# Altium project bldc_board.PrjPcb
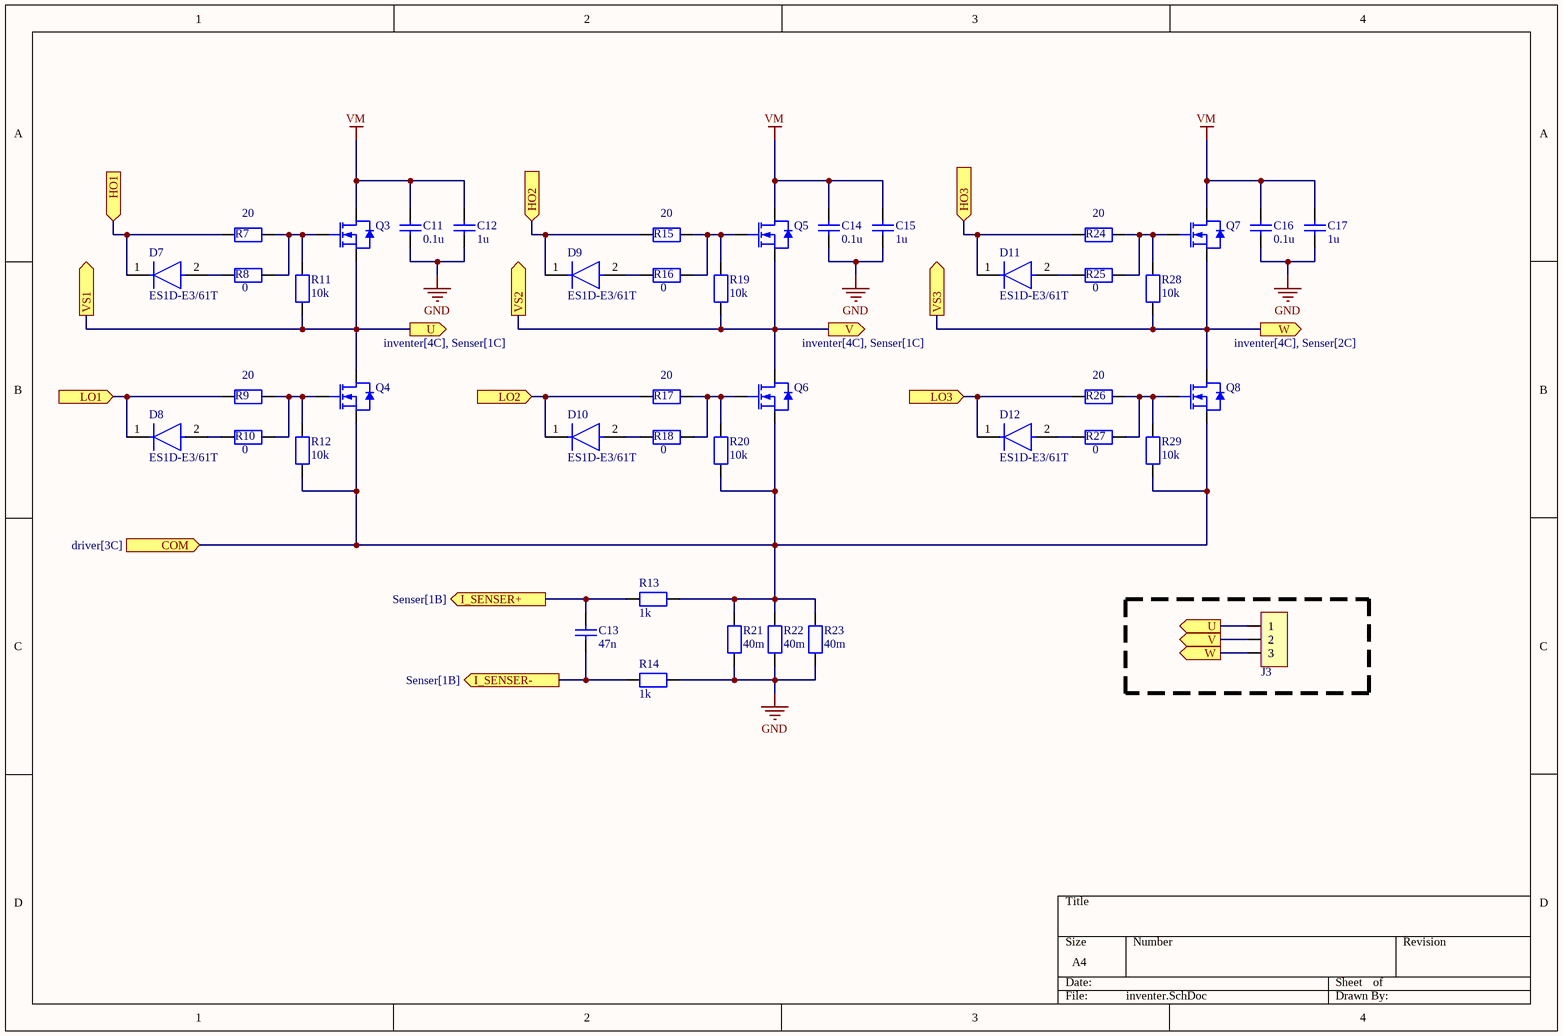
[diagram p0: inventer.SchDoc]
5 sheets, 190 parts. Net scope: flat (ports and power ports of the same name join across sheets).
Board file: My_PCB.PcbDoc
Sheets:
  inventer.SchDoc
  power.SchDoc
  driver.SchDoc
  Senser.SchDoc
  mcu.SchDoc

## Sheet inventer.SchDoc
size A4; SheetNumber: 1; SheetTotal: 5

### Parts
C11  value 0.1u  [CAP_1206]  (hidden comment: CAP)
C12  value 1u  [CAP_1206]  (hidden comment: CAP)
C13  value 47n  [CAPC2012X06N]  (hidden comment: CAP)
C14  value 0.1u  [CAP_1206]  (hidden comment: CAP)
C15  value 1u  [CAP_1206]  (hidden comment: CAP)
C16  value 0.1u  [CAP_1206]  (hidden comment: CAP)
C17  value 1u  [CAP_1206]  (hidden comment: CAP)
D7  ES1D-E3/61T  [FP-95400-MFG]
D8  ES1D-E3/61T  [FP-95400-MFG]
D9  ES1D-E3/61T  [FP-95400-MFG]
D10  ES1D-E3/61T  [FP-95400-MFG]
D11  ES1D-E3/61T  [FP-95400-MFG]
D12  ES1D-E3/61T  [FP-95400-MFG]
J3  Power 3  [Power 3]  (value not drawn)
Q3  IRF1010ZSTRLPBF  [FP-PG-TO263-3-MFG]  (value not drawn)
Q4  IRF1010ZSTRLPBF  [FP-PG-TO263-3-MFG]  (value not drawn)
Q5  IRF1010ZSTRLPBF  [FP-PG-TO263-3-MFG]  (value not drawn)
Q6  IRF1010ZSTRLPBF  [FP-PG-TO263-3-MFG]  (value not drawn)
Q7  IRF1010ZSTRLPBF  [FP-PG-TO263-3-MFG]  (value not drawn)
Q8  IRF1010ZSTRLPBF  [FP-PG-TO263-3-MFG]  (value not drawn)
R7  value 20  [RESC3016X06N]  (hidden comment: 1k)
R8  value 0  [RESC3016X06N]  (hidden comment: 1k)
R9  value 20  [RESC3016X06N]  (hidden comment: 1k)
R10  value 0  [RESC3016X06N]  (hidden comment: 1k)
R11  10k  [RESC2012X06N]
R12  10k  [RESC2012X06N]
R13  value 1k  [RESC2012X06N]  (hidden comment: Resistor)
R14  value 1k  [RESC2012X06N]  (hidden comment: Resistor)
R15  value 20  [RESC3016X06N]  (hidden comment: 1k)
R16  value 0  [RESC3016X06N]  (hidden comment: 1k)
R17  value 20  [RESC3016X06N]  (hidden comment: 1k)
R18  value 0  [RESC3016X06N]  (hidden comment: 1k)
R19  10k  [RESC2012X06N]
R20  10k  [RESC2012X06N]
R21  value 40m  [RESC2512]  (hidden comment: Resistor)
R22  value 40m  [RESC2512]  (hidden comment: Resistor)
R23  value 40m  [RESC2512]  (hidden comment: Resistor)
R24  value 20  [RESC3016X06N]  (hidden comment: 1k)
R25  value 0  [RESC3016X06N]  (hidden comment: 1k)
R26  value 20  [RESC3016X06N]  (hidden comment: 1k)
R27  value 0  [RESC3016X06N]  (hidden comment: 1k)
R28  10k  [RESC2012X06N]
R29  10k  [RESC2012X06N]

### Ports
COM (in, see driver[3C]), HO1 (in, see driver[2A]), HO2 (in, see driver[4A]), HO3 (in, see driver[2C]), I_SENSER+ (out, see Senser[1B]), I_SENSER- (out, see Senser[1B]), LO1 (in, see driver[2B]), LO2 (in, see driver[4B]), LO3 (in, see driver[2C]), U (out, see inventer[2B], Senser[1C]), U (out, see inventer[4C], Senser[1C]), V (out, see inventer[3B], Senser[1C]), V (out, see inventer[4C], Senser[1C]), VS1 (out, see driver[2A]), VS2 (out, see driver[4A]), VS3 (out, see driver[2C]), W (out, see inventer[4B], Senser[2C]), W (out, see inventer[4C], Senser[2C])

### Nets
GND: C11.2 C12.2 C14.2 C15.2 C16.2 C17.2 R14.1 R21.1 R22.1 R23.1
VM: C11.1 C12.1 C14.1 C15.1 C16.1 C17.1 Q3.D Q5.D Q7.D
com: Q4.S Q6.S Q8.S R12.1 R13.1 R20.1 R21.2 R22.2 R23.2 R29.1 ; port COM
U: J3.1 Q3.S Q4.D R11.1 ; port VS1, port U
V: J3.2 Q5.S Q6.D R19.1 ; port VS2, port V
NetC13_1: C13.1 R13.2 ; port I_SENSER+
NetC13_2: C13.2 R14.2 ; port I_SENSER-
NetC20_2: J3.3 Q7.S Q8.D R28.1 ; port VS3, port W
NetD7_1: D7.1(C) R7.1 ; port HO1
NetD7_2: D7.2(A) R8.1
NetD8_1: D8.1(C) R9.1 ; port LO1
NetD8_2: D8.2(A) R10.1
NetD9_1: D9.1(C) R15.1 ; port HO2
NetD9_2: D9.2(A) R16.1
NetD10_1: D10.1(C) R17.1 ; port LO2
NetD10_2: D10.2(A) R18.1
NetD11_1: D11.1(C) R24.1 ; port HO3
NetD11_2: D11.2(A) R25.1
NetD12_1: D12.1(C) R26.1 ; port LO3
NetD12_2: D12.2(A) R27.1
NetQ3_G: Q3.G R7.2 R8.2 R11.2
NetQ4_G: Q4.G R9.2 R10.2 R12.2
NetQ5_G: Q5.G R15.2 R16.2 R19.2
NetQ6_G: Q6.G R17.2 R18.2 R20.2
NetQ7_G: Q7.G R24.2 R25.2 R28.2
NetQ8_G: Q8.G R26.2 R27.2 R29.2

### Library data of the parts
C11 C14 C16 = CAP: Конденсатор керамический smd 0.1 мкФ X7R 50В 10% 1206,; Source: *
C12 C15 C17 = CAP: Конденсатор керамический smd 1 мкФ X7R 50В,10%, 1206; Source: *
C13 = CAP: Конденсатор керамический smd 0.047мкФ X7R 50В 10% 0805; Source: *
D7-D12 = CMP-02540-000037-1: DIODE GEN PURP 200V 1A DO214AC; Manufacturer: Vishay; Standoff Height: 0mm; Peak Reverse Current: 5uA; Value: 10 pF; Max Surge Forward Current: 30A; Max Junction Temp: +150°C; Device Class L3: Rectifier Diodes; RoHS: TRUE; Device Class L1: Discrete Semiconductors; Lead Free: Yes; ComponentLink2Description: Datasheet; Digikey Description: DIODE GEN PURP 200V 1A DO214AC; Device Class L2: Diodes; Package: 95400; Max Repetitive Reverse Voltage: 200V; Footprint Url: http://www.vishay.com/docs/95400/sma.pdf; Temperature Range High: +150°C; ComponentLink2URL: http://www.vishay.com/docs/88586/es1.pdf; Automotive: No; Octopart: https://octopart.com/es1d-e3%2F61t-vishay-39550266; Manufacturer Part Number: ES1D-E3/61T; Temperature: -55°C to +150°C; Category: Diode; Temperature Range Low: -55°C; Height: 2.29mm; Capacitance: 10 pF; Mouser Description: Ultrafast Rectifier, Plastic Surface Mount, 1 A, 200 VDC, DO0214AC (SMA), RoHS; Forward Current: 1A
Q3-Q8 = NMOS: IRF1010ZSTRLPBF, Транзистор HEXFET N-канал 55В 75А; Source: https://www.chipdip.ru/product/irf1010zstrlpbf-infineon
R7 R9 R15 R17 R24 R26 = Resistor: 0.25Вт 1206 20 Ом, 1%; Source: *
R8 R10 R16 R18 R25 R27 = Resistor: 0.25Вт 1206 (перемычка) 0 Ом; Source: *
R11 R12 R19 R20 R28 R29 = Resistor: 0.125Вт 0805 10 кОм, 1%; Value: 10k; Source: *
R13 R14 = Resistor: 0.125Вт 0805 1 кОм, 1%; Source: *
R21-R23 = Resistor: Source: *

## Sheet power.SchDoc
size A4; SheetNumber: 2; SheetTotal: 5
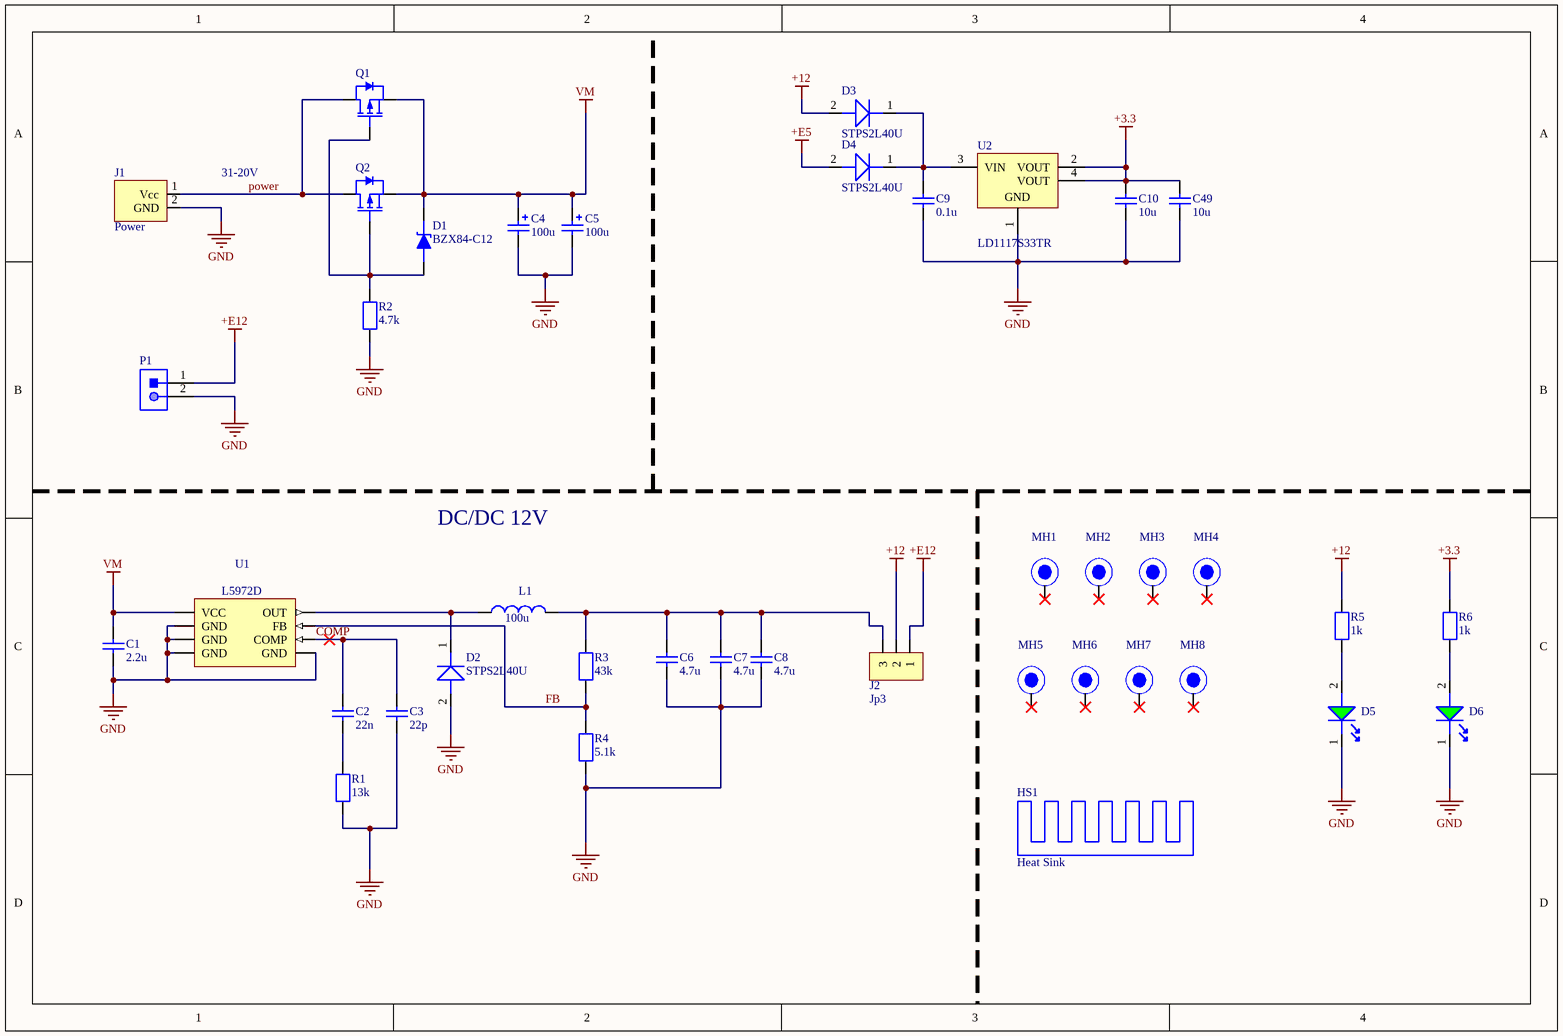
[diagram p1: power.SchDoc]

### Parts
C1  value 2.2u  [CAP_1206]  (hidden comment: CAP)
C2  value 22n  [CAPC2012X06N]  (hidden comment: CAP)
C3  value 22p  [CAPC2012X06N]  (hidden comment: CAP)
C4  value 100u  [B40940]  (hidden comment: Cap_Pos)
C5  value 100u  [B40940]  (hidden comment: Cap_Pos)
C6  value 4.7u  [CAP_1206]  (hidden comment: CAP)
C7  value 4.7u  [CAP_1206]  (hidden comment: CAP)
C8  value 4.7u  [CAP_1206]  (hidden comment: CAP)
C9  value 0.1u  [CAPC2012X06N]  (hidden comment: CAP)
C10  value 10u  [CAPC2012X06N]  (hidden comment: CAP)
C49  value 10u  [CAPC2012X06N]  (hidden comment: CAP)
D1  BZX84-C12  [SOT23]
D2  STPS2L40U  [CAPM3216X18N]
D3  STPS2L40U  [CAPM3216X18N]
D4  STPS2L40U  [CAPM3216X18N]
D5  GREEN  [DIOC3216X06N]  (value not drawn)
D6  GREEN  [DIOC3216X06N]  (value not drawn)
HS1  Heat Sink  [Heat Sink]
J1  Power  [Power Connector]
J2  Jp3  [HEADER 1x3 2.54mm]
L1  value 100u  [HE1040]  (hidden comment: HE1040)
MH1  MH  [MH]  (value not drawn)
MH2  MH  [MH]  (value not drawn)
MH3  MH  [MH]  (value not drawn)
MH4  MH  [MH]  (value not drawn)
MH5  MH  [MH]  (value not drawn)
MH6  MH  [MH]  (value not drawn)
MH7  MH  [MH]  (value not drawn)
MH8  MH  [MH]  (value not drawn)
P1  B2P-VH(LF)(SN)  [JST-B2P-VH(LF)(SN)_V]  (value not drawn)
Q1  IRF4905STRLPBF  [FP-PG-TO263-3-MFG]  (value not drawn)
Q2  IRF4905STRLPBF  [FP-PG-TO263-3-MFG]  (value not drawn)
R1  value 13k  [RESC2012X06N]  (hidden comment: Resistor)
R2  value 4.7k  [RESC2012X06N]  (hidden comment: Resistor)
R3  value 43k  [RESC2012X06N]  (hidden comment: Resistor)
R4  value 5.1k  [RESC2012X06N]  (hidden comment: Resistor)
R5  value 1k  [RESC2012X06N]  (hidden comment: Resistor)
R6  value 1k  [RESC2012X06N]  (hidden comment: Resistor)
U1  L5972D  [SO-8]
U2  LD1117S33TR  [STM-SOT-223_M]

### Nets
+3.3: C10.1 C49.1 R6.2 U2.2(VOUT) U2.4(VOUT)
+12: D3.2(A) J2.2 R5.2
+E5: D4.2(A)
+E12: J2.1 P1.1
GND: C1.2 C3.2 C4.2 C5.2 C6.2 C7.2 C8.2 C9.2 C10.2 C49.2 D2.2(A) D5.1 D6.1 J1.2(GND) P1.2 R1.1 R2.1 R4.1 U1.2(GND) U1.3(GND) U1.6(GND) U1.7(GND) U2.1(GND)
VM: C1.1 C4.1 C5.1 D1.3 Q1.S Q2.S U1.8(VCC)
COMP: C2.1 C3.1 U1.4(COMP)
FB: R3.1 R4.2 U1.5(FB)
power: J1.1(Vcc) Q1.D Q2.D
NetC2_2: C2.2 R1.2
NetC6_1: C6.1 C7.1 C8.1 J2.3 L1.2 R3.2
NetC9_1: C9.1 D3.1(K) D4.1(K) U2.3(VIN)
NetD1_1: D1.1 Q1.G Q2.G R2.2
NetD2_1: D2.1(K) L1.1 U1.1(OUT)
NetD5_2: D5.2 R5.1
NetD6_2: D6.2 R6.1

Not connected (* = marked no-connect by the designer): MH1 1*; MH2 1*; MH3 1*; MH4 1*; MH5 1*; MH6 1*; MH7 1*; MH8 1*

### Notes on the sheet
- 31-20V
- DC/DC 12V

### Library data of the parts
C1 = CAP: GRM21BR71E225K, Конденсатор керамический smd 2.2мкФ X7R 25В 0805; Source: *
C2 = CAP: GRM31MR72A223K, Конденсатор керамический smd 0.022мкФ 100В X7R, 10%; Source: *
C3 = CAP: GRM21A5C2E220J, Конденсатор керамический smd 22пФ C0G 250B 5% 0805; Source: *
C4 C5 = Cap_Pos: B40940A8107M000, 100 мкФ, 63 В,10х12.5, 20%
C6-C8 = CAP: GRM21BR61E475KA12L, Конденсатор керамический smd 4.7 мкФ X5R 10% 25В 0805; Source: *
C9 = CAP: Конденсатор керамический smd 0.01 мкФ NPO 50В 5%; Source: *
C10 C49 = CAP: Capacitor SMD 0805 X7R 10uФ 25В 10%; Source: *
D1 = BZX84-C12: BZX84-C12,215, Стабилитрон 12В, 5%
D2-D4 = DIOD: STPS2L40U, Диод Шоттки 40В 2А; Name: *
D5 D6 = LED_G: TO-3216BC-BF, Светодиод синий SMD 3216
HS1 = Heat Sink: HS 145-100, Радиатор 100х100х26 мм
J2 = Jumper3: PLS-3 (DS1021-1x3), Вилка штыревая 2.54мм 1x3pin
L1 = L: HE1040 101M2B 100мкГн ± 25%
P1 = CMP-002-00025-2: Male Header, Pitch 3.96 mm, 1 x 2 Position, Height 10.9 mm, Tail Length 3.7 mm, -25 to 85 degC, RoHS, Bulk; Manufacturer: JST; Case/Package: B2P-VH(LF)(SN); Connector Type: Header; Mounting Technology: TH; Package Reference: B2P-VH(LF)(SN); Package Description: Male Header, Pitch 3.96 mm, 1 x 2 Position, Height 10.9 mm, Tail Length 3.7 mm; Max Operating Temperature: 85°C; Manufacturer URL: http://www.jst.com/home2.html; RoHS Compliant: Unknown; Datasheet Version: May-16; Gender: Male; Min Operating Temperature: -25°C; Datasheet URL: http://www.jst-mfg.com/product/pdf/eng/eVH.pdf
Q1 Q2 = PMOS: IRF4905STRLPBF, Транзистор HEXFET, P-канал, 55В, 74А
R1 = Resistor: 0.125Вт 0805 13 кОм, 1%; Source: *
R2 = Resistor: 0.125Вт 0805 4.7 кОм, 1%; Source: *
R3 = Resistor: 0.125Вт 0805 43 кОм, 1%; Source: *
R4 = Resistor: 0.125Вт 0805 5.1 кОм, 1%; Source: *
R5 R6 = Resistor: 0.125Вт 0805 1 кОм, 1%; Source: *
U1 = L5972D: Buck Switching Regulator IC Positive Adjustable 1.235V 1 Output 2A 8-SOIC (0.154", 3.90mm Width)
U2 = CMP-019-00019-3: Low Drop Positive Voltage Regulator, 800 mA, Fixed 3.3 V Output, 0 to 125 degC, 3-Pin TO-220, RoHS, Tape and Reel; Manufacturer: STMicroelectronics; Max Supply Voltage: 15V; Dropout Voltage: 1.1V; Power: 12W; Output Current: 950mA; Min Input Voltage: 4.75V; Nominal Output Voltage: 3.3V; Max Ouput Current: 1.3A; Outputs: 1; Packaging: TapeandReel; Datasheet Version: Rev. 33, 11/2013; RoHS Compliant: True; Mounting Technology: SM; Max Input Voltage: 15V; Max Operating Temperature: 125°C; Package Reference: SOT-223; Package Quantity: 2500; Package Description: 4-Pin Small Outline Transistor, Body 6.5 x 3.5 mm, Pitch 2.3 mm; Case/Package: TO-261-4; Min Operating Temperature: 0°C; Datasheet URL: http://www.farnell.com/datasheets/1776449.pdf; Min Supply Voltage: 4.75V; Pins: 3; Output Voltage: 3.3V; Manufacturer URL: http://www.st.com/

## Sheet driver.SchDoc
size A4; SheetNumber: 3; SheetTotal: 5
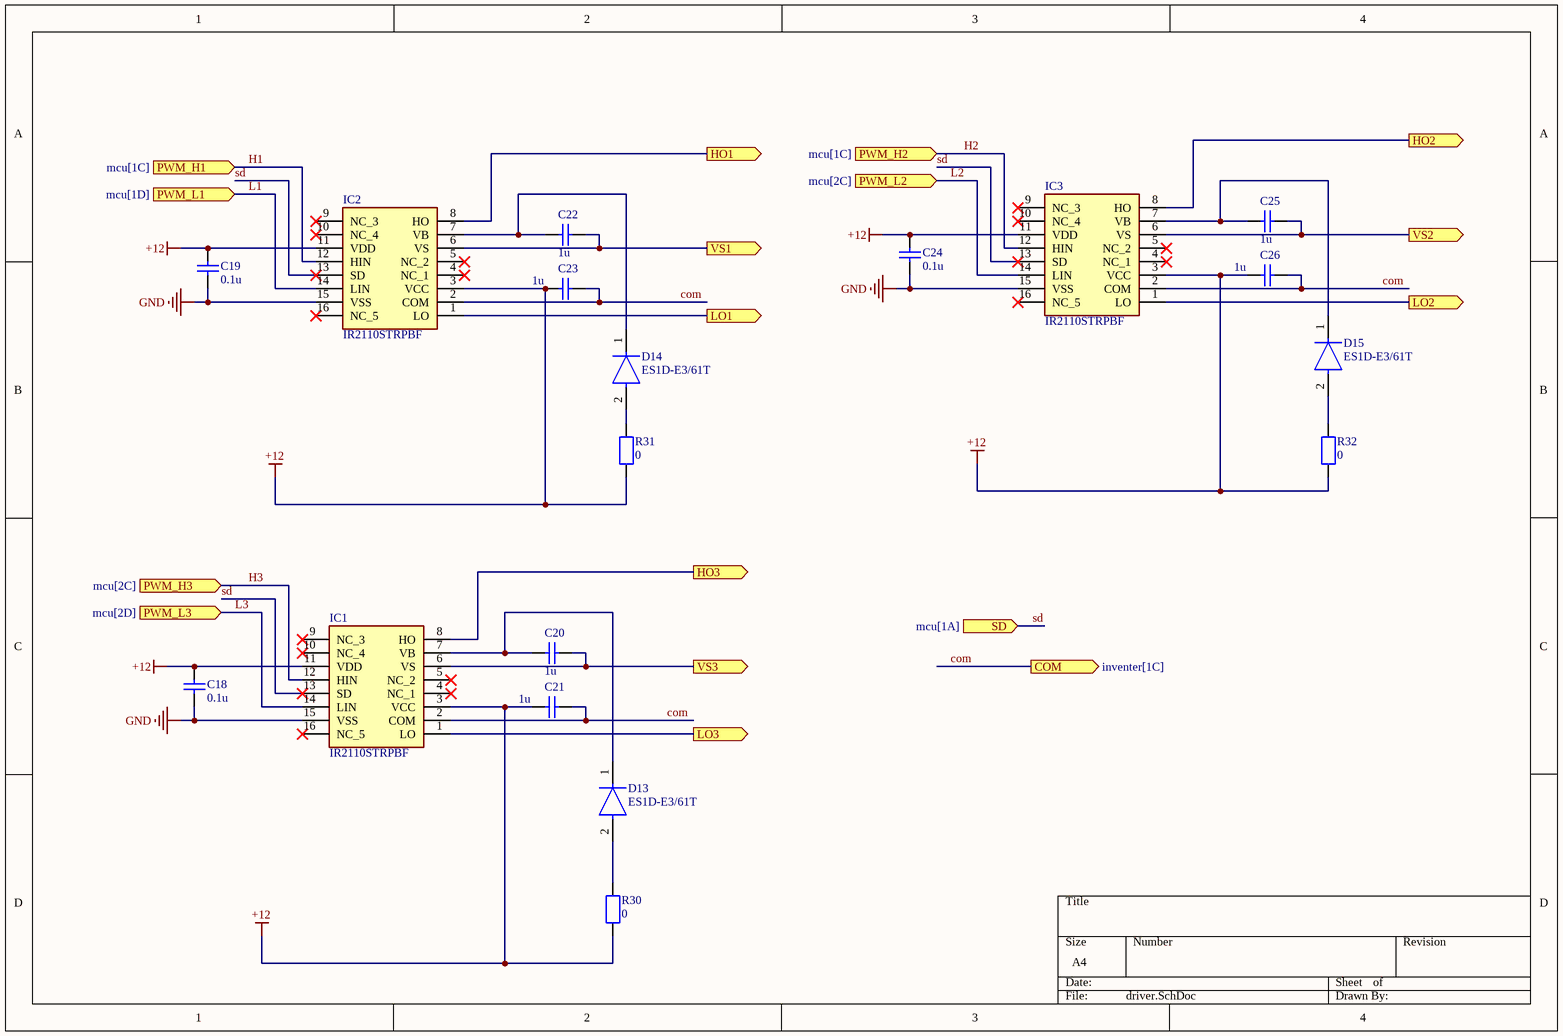
[diagram p2: driver.SchDoc]

### Parts
C18  value 0.1u  [CAPC2012X06N]  (hidden comment: CAP)
C19  value 0.1u  [CAPC2012X06N]  (hidden comment: CAP)
C20  value 1u  [CAPC2012X06N]  (hidden comment: CAP)
C21  value 1u  [CAPC2012X06N]  (hidden comment: CAP)
C22  value 1u  [CAPC2012X06N]  (hidden comment: CAP)
C23  value 1u  [CAPC2012X06N]  (hidden comment: CAP)
C24  value 0.1u  [CAPC2012X06N]  (hidden comment: CAP)
C25  value 1u  [CAPC2012X06N]  (hidden comment: CAP)
C26  value 1u  [CAPC2012X06N]  (hidden comment: CAP)
D13  ES1D-E3/61T  [FP-95400-MFG]
D14  ES1D-E3/61T  [FP-95400-MFG]
D15  ES1D-E3/61T  [FP-95400-MFG]
IC1  IR2110STRPBF  [SOIC127P1032X265-16N]
IC2  IR2110STRPBF  [SOIC127P1032X265-16N]
IC3  IR2110STRPBF  [SOIC127P1032X265-16N]
R30  value 0  [RESC3016X06N]  (hidden comment: Resistor)
R31  value 0  [RESC3016X06N]  (hidden comment: Resistor)
R32  value 0  [RESC3016X06N]  (hidden comment: Resistor)

### Ports
COM (out, see inventer[1C]), HO1 (out, see inventer[1A]), HO2 (out, see inventer[2A]), HO3 (out, see inventer[3A]), LO1 (out, see inventer[1B]), LO2 (out, see inventer[2B]), LO3 (out, see inventer[3B]), PWM_H1 (in, see mcu[1C]), PWM_H2 (in, see mcu[1C]), PWM_H3 (in, see mcu[2C]), PWM_L1 (in, see mcu[1D]), PWM_L2 (in, see mcu[2C]), PWM_L3 (in, see mcu[2D]), SD (in, see mcu[1A]), VS1 (out, see inventer[1B]), VS2 (out, see inventer[2B]), VS3 (out, see inventer[3B])

### Nets
+12: C18.1 C19.1 C21.2 C23.2 C24.1 C26.2 IC1.3(VCC) IC1.11(VDD) IC2.3(VCC) IC2.11(VDD) IC3.3(VCC) IC3.11(VDD) R30.1 R31.1 R32.1
GND: C18.2 C19.2 C24.2 IC1.15(VSS) IC2.15(VSS) IC3.15(VSS)
com: C21.1 C23.1 C26.1 IC1.2(COM) IC2.2(COM) IC3.2(COM) ; port COM
H1: IC2.12(HIN) ; port PWM_H1
H2: IC3.12(HIN) ; port PWM_H2
H3: IC1.12(HIN) ; port PWM_H3
L1: IC2.14(LIN) ; port PWM_L1
L2: IC3.14(LIN) ; port PWM_L2
L3: IC1.14(LIN) ; port PWM_L3
sd: IC1.13(SD) IC2.13(SD) IC3.13(SD) ; port SD
U: C22.2 IC2.6(VS) ; port VS1
V: C25.2 IC3.6(VS) ; port VS2
NetC20_1: C20.1 D13.1(C) IC1.7(VB)
NetC20_2: C20.2 IC1.6(VS) ; port VS3
NetC22_1: C22.1 D14.1(C) IC2.7(VB)
NetC25_1: C25.1 D15.1(C) IC3.7(VB)
NetD7_1: IC2.8(HO) ; port HO1
NetD8_1: IC2.1(LO) ; port LO1
NetD9_1: IC3.8(HO) ; port HO2
NetD10_1: IC3.1(LO) ; port LO2
NetD11_1: IC1.8(HO) ; port HO3
NetD12_1: IC1.1(LO) ; port LO3
NetD13_2: D13.2(A) R30.2
NetD14_2: D14.2(A) R31.2
NetD15_2: D15.2(A) R32.2

Not connected (* = marked no-connect by the designer): IC1 4(NC_1)* 5(NC_2)* 9(NC_3)* 10(NC_4)* 16(NC_5)*; IC2 4(NC_1)* 5(NC_2)* 9(NC_3)* 10(NC_4)* 16(NC_5)*; IC3 4(NC_1)* 5(NC_2)* 9(NC_3)* 10(NC_4)* 16(NC_5)*

### Library data of the parts
C18 C19 C24 = CAP: as C9 on sheet power; Source: *
C20-C23 C25 C26 = CAP: Конденсатор керамический smd 1 мкФ X7R 10% 50В 0805; Source: *
D13-D15 = CMP-02540-000037-1: as D7 on sheet inventer; Device Class L3: Rectifier Diodes; RoHS: TRUE; Device Class L1: Discrete Semiconductors; Lead Free: Yes; ComponentLink2Description: Datasheet; Digikey Description: DIODE GEN PURP 200V 1A DO214AC; Device Class L2: Diodes; Package: 95400; Max Repetitive Reverse Voltage: 200V; Footprint Url: http://www.vishay.com/docs/95400/sma.pdf; Temperature Range High: +150°C; ComponentLink2URL: http://www.vishay.com/docs/88586/es1.pdf; Automotive: No; Octopart: https://octopart.com/es1d-e3%2F61t-vishay-39550266; Manufacturer Part Number: ES1D-E3/61T; Temperature: -55°C to +150°C; Category: Diode; Temperature Range Low: -55°C; Height: 2.29mm; Capacitance: 10 pF; Mouser Description: Ultrafast Rectifier, Plastic Surface Mount, 1 A, 200 VDC, DO0214AC (SMA), RoHS; Forward Current: 1A
IC1-IC3 = IR2110STRPBF: IR2110STRPBF, Полумостовой драйвер HIGH/LOW SIDE; Manufacturer_Name: Infineon; Datasheet Link: https://www.infineon.com/cms/en/product/power/gate-driver-ics/?; Height: 2.65mm; Manufacturer_Part_Number: IR2110STRPBF; Mouser Part Number: 942-IR2110STRPBF; Mouser Price/Stock: https://www.mouser.co.uk/ProductDetail/Infineon-Technologies/IR2110STRPBF?qs=2r01AXMCG3P4pNuJUqFzxg%3D%3D; Arrow Part Number: IR2110STRPBF; Arrow Price/Stock: https://www.arrow.com/en/products/ir2110strpbf/infineon-technologies-ag?region=nac
R30-R32 = Resistor: Source: *

## Sheet Senser.SchDoc
size A4; SheetNumber: 4; SheetTotal: 5
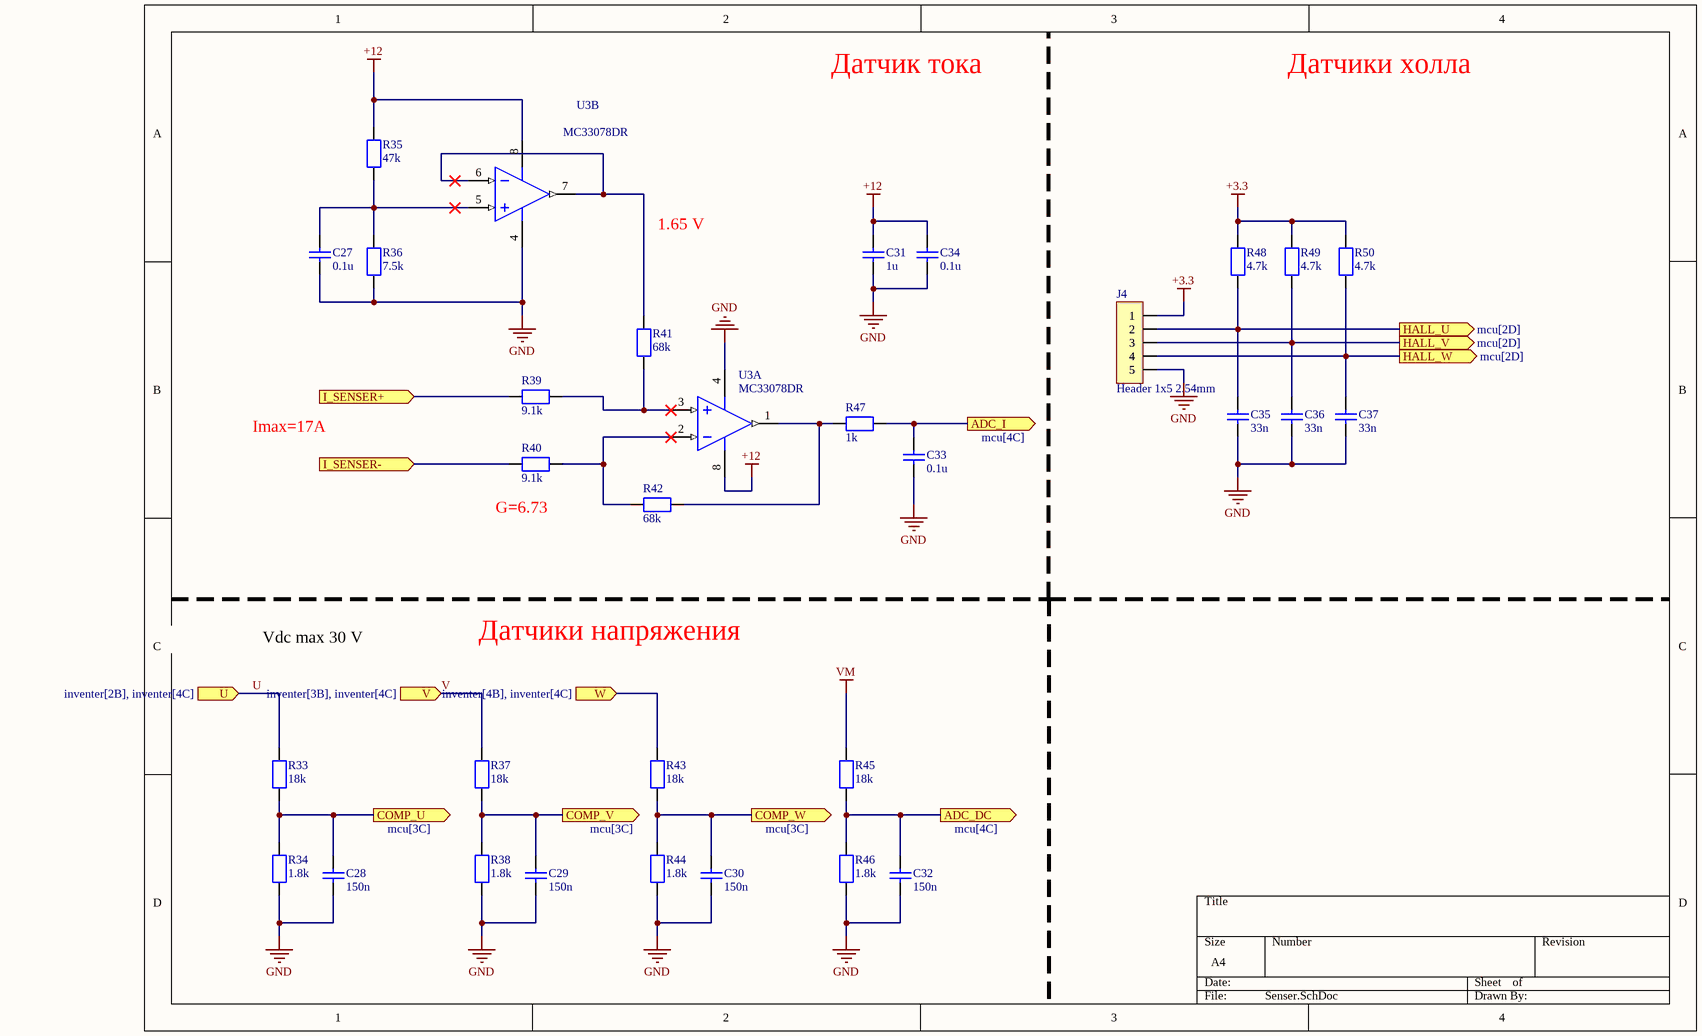
[diagram p3: Senser.SchDoc]

### Parts
C27  value 0.1u  [CAPC2012X06N]  (hidden comment: CAP)
C28  value 150n  [CAPC2012X06N]  (hidden comment: CAP)
C29  value 150n  [CAPC2012X06N]  (hidden comment: CAP)
C30  value 150n  [CAPC2012X06N]  (hidden comment: CAP)
C31  value 1u  [CAPC2012X06N]  (hidden comment: CAP)
C32  value 150n  [CAPC2012X06N]  (hidden comment: CAP)
C33  value 0.1u  [CAPC2012X06N]  (hidden comment: CAP)
C34  value 0.1u  [CAPC2012X06N]  (hidden comment: CAP)
C35  value 33n  [CAPC2012X06N]  (hidden comment: CAP)
C36  value 33n  [CAPC2012X06N]  (hidden comment: CAP)
C37  value 33n  [CAPC2012X06N]  (hidden comment: CAP)
J4  Header 1x5 2.54mm  [Header 1x5 2.54mm]
R33  value 18k  [RESC2012X06N]  (hidden comment: Resistor)
R34  value 1.8k  [RESC2012X06N]  (hidden comment: Resistor)
R35  value 47k  [RESC2012X06N]  (hidden comment: Resistor)
R36  value 7.5k  [RESC2012X06N]  (hidden comment: Resistor)
R37  value 18k  [RESC2012X06N]  (hidden comment: Resistor)
R38  value 1.8k  [RESC2012X06N]  (hidden comment: Resistor)
R39  value 9.1k  [RESC2012X06N]  (hidden comment: Resistor)
R40  value 9.1k  [RESC2012X06N]  (hidden comment: Resistor)
R41  value 68k  [RESC2012X06N]  (hidden comment: Resistor)
R42  value 68k  [RESC2012X06N]  (hidden comment: Resistor)
R43  value 18k  [RESC2012X06N]  (hidden comment: Resistor)
R44  value 1.8k  [RESC2012X06N]  (hidden comment: Resistor)
R45  value 18k  [RESC2012X06N]  (hidden comment: Resistor)
R46  value 1.8k  [RESC2012X06N]  (hidden comment: Resistor)
R47  value 1k  [RESC2012X06N]  (hidden comment: Resistor)
R48  value 4.7k  [RESC2012X06N]  (hidden comment: Resistor)
R49  value 4.7k  [RESC2012X06N]  (hidden comment: Resistor)
R50  value 4.7k  [RESC2012X06N]  (hidden comment: Resistor)
U3  MC33078DR  [D0008A_L]  (parts A,B of 2)

### Ports
ADC_DC (out, see mcu[4C]), ADC_I (out, see mcu[4C]), COMP_U (out, see mcu[3C]), COMP_V (out, see mcu[3C]), COMP_W (out, see mcu[3C]), HALL_U (out, see mcu[2D]), HALL_V (out, see mcu[2D]), HALL_W (out, see mcu[2D]), I_SENSER+ (in, see inventer[2C]), I_SENSER- (in, see inventer[2C]), U (in, see inventer[2B], inventer[4C]), V (in, see inventer[3B], inventer[4C]), W (in, see inventer[4B], inventer[4C])

### Nets
+3.3: J4.1 R48.2 R49.2 R50.2
+12: C31.1 C34.1 R35.2 U3.8(VCC+)
GND: C27.2 C28.2 C29.2 C30.2 C31.2 C32.2 C33.2 C34.2 C35.2 C36.2 C37.2 J4.5 R34.1 R36.1 R38.1 R44.1 R46.1 U3.4(VCC-)
VM: R45.2
U: R33.2 ; port U
V: R37.2 ; port V
NetC13_1: R39.1 ; port I_SENSER+
NetC13_2: R40.1 ; port I_SENSER-
NetC20_2: R43.2 ; port W
NetC27_1: C27.1 R35.1 R36.2 U3.5(IN2+)
NetC28_1: C28.1 R33.1 R34.2 ; port COMP_U
NetC29_1: C29.1 R37.1 R38.2 ; port COMP_V
NetC30_1: C30.1 R43.1 R44.2 ; port COMP_W
NetC32_1: C32.1 R45.1 R46.2 ; port ADC_DC
NetC33_1: C33.1 R47.2 ; port ADC_I
NetC35_1: C35.1 J4.2 R48.1 ; port HALL_U
NetC36_1: C36.1 J4.3 R49.1 ; port HALL_V
NetC37_1: C37.1 J4.4 R50.1 ; port HALL_W
NetR39_2: R39.2 R41.1 U3.3(IN1+)
NetR40_2: R40.2 R42.2 U3.2(IN1-)
NetR41_2: R41.2 U3.6(IN2-) U3.7(OUT2)
NetR42_1: R42.1 R47.1 U3.1(OUT1)

### Notes on the sheet
- Датчик тока
- Датчики холла
- 1.65 V
- Imax=17A
- (near R40) G=6.73
- Vdc max 30 V
- Датчики напряжения

### Library data of the parts
C27 C34 = CAP: Конденсатор керамический smd 0.1 мкФ X7R 50В 10% 0805; Source: *
C28-C30 C32 = CAP: Конденсатор керамический smd 0.15мкФ X7R 50В 10% 0805; Source: *
C31 = CAP: as C20 on sheet driver; Source: *
C33 = CAP: as C9 on sheet power; Source: *
C35-C37 = CAP: Конденсатор керамический smd 0.033мкФ X7R 50В 10% 0805; Source: *
J4 = Header 1x5: PLS-5 (DS1021-1x5), Вилка штыревая 2.54мм 1x5pin
R33 R37 R43 R45 = Resistor: 0.125Вт 0805 12 кОм, 1%; Source: *
R34 R38 R44 R46 = Resistor: 0.125Вт 0805 1.5 кОм, 1%; Source: *
R35 = Resistor: 0.125Вт 0805 47 кОм, 1%; Source: *
R36 = Resistor: 0.125Вт 0805 7.5 кОм, 1%; Source: *
R39 R40 = Resistor: 0.125Вт 0805 9.1 кОм, 1%; Source: *
R41 R42 = Resistor: 0.125Вт 0805 68 кОм, 1%; Source: *
R47 = Resistor: 0.125Вт 0805 1 кОм, 1%; Source: *
R48-R50 = Resistor: 0.125Вт 0805 4.7 кОм, 1%; Source: *
U3 = CMP-0017-00420-2: Dual High-Speed Low-Noise Operational Amplifier, 10 to 36 V, -40 to 85 degC, 8-pin SOIC (D8), Green (RoHS & no Sb/Br); Manufacturer: Texas Instruments; Total Supply Voltage(Min)(+5V is 5, +/-5V is 10): 10; Slew Rate(Typ)(V/us): 7; Offset Drift(Typ)(uV/C): 2; CMRR(Min)(dB): 80; Sub Family: General Purpose Amplifier, High Supply Voltage Amplifier (>=30V), Low Noise Amp (<=10nV/rtHz); GBW(Typ)(MHz): 16; Iq per channel(Max)(mA): 2.5; Vn at 1kHz(Typ)(nV/rtHz): 4.5; Total Supply Voltage(Max)(+5V is 5, +/-5V is 10): 36; Rating: Catalog; IIB(Max)(pA): 750000; ComponentLink1URL: http://www.ti.com/; ComponentLink2Description: Datasheet; ComponentLink3URL: http://www.ti.com/litv/pdf/msoi002j; Number of Channels: 2; Mounting Technology: Surface Mount; Vio (25C)(Max)(mV): 2; DatasheetVersion: SLLS633C; PackageDescription: 8-Pin Plastic Small Outline, Body 4.9 x 3.9 mm, Pitch 1.27 mm; Eco-Plan: Green (RoHS & no Sb/Br); ComponentLink1Description: Manufacturer URL; PackageVersion: 4040047-3/M, 06/2011; ComponentLink3Description: Package Specification; PackageReference: D0008A; PartNumber: MC33078DR; Code_JEDEC: MS-012; ComponentLink2URL: http://www.ti.com/lit/ds/symlink/mc33078.pdf

## Sheet mcu.SchDoc
size A3; SheetNumber: 5; SheetTotal: 5
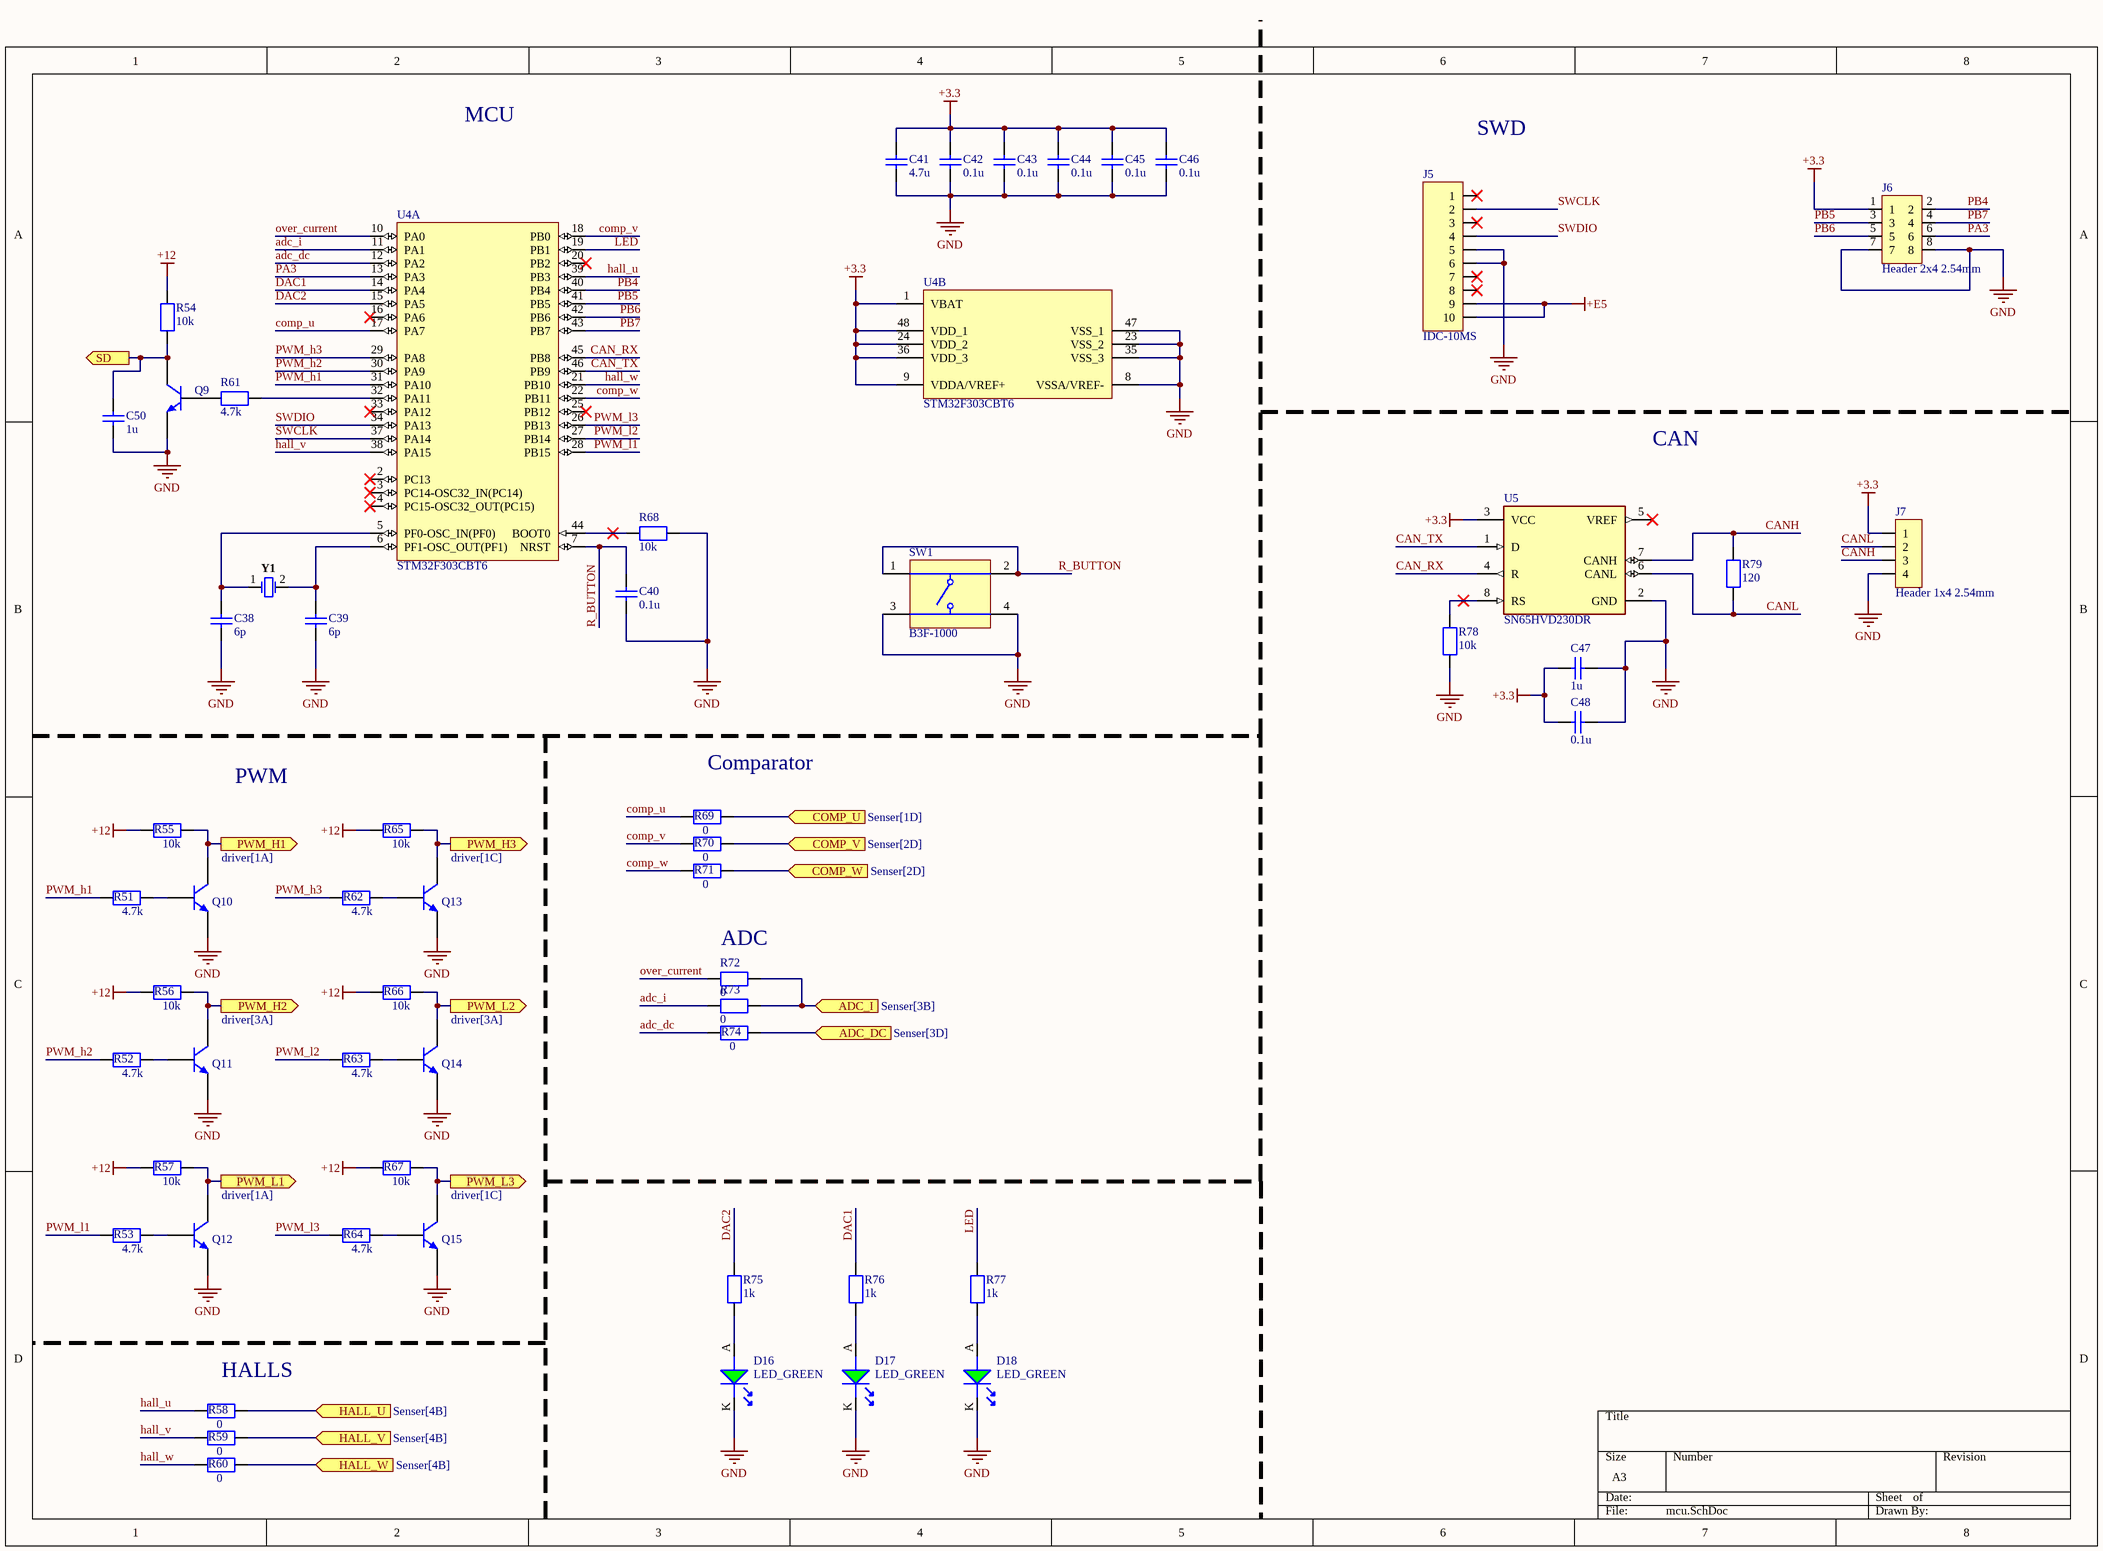
[diagram p4: mcu.SchDoc]

### Parts
C38  value 6p  [CAPC2012X06N]  (hidden comment: CAP)
C39  value 6p  [CAPC2012X06N]  (hidden comment: CAP)
C40  value 0.1u  [CAPC2012X06N]  (hidden comment: CAP)
C41  value 4.7u  [CAPC2012X06N]  (hidden comment: CAP)
C42  value 0.1u  [CAPC2012X06N]  (hidden comment: CAP)
C43  value 0.1u  [CAPC2012X06N]  (hidden comment: CAP)
C44  value 0.1u  [CAPC2012X06N]  (hidden comment: CAP)
C45  value 0.1u  [CAPC2012X06N]  (hidden comment: CAP)
C46  value 0.1u  [CAPC2012X06N]  (hidden comment: CAP)
C47  value 1u  [CAPC2012X06N]  (hidden comment: CAP)
C48  value 0.1u  [CAPC2012X06N]  (hidden comment: CAP)
C50  value 1u  [CAPC2012X06N]  (hidden comment: CAP)
D16  LED_GREEN  [LED_3216]
D17  LED_GREEN  [LED_3216]
D18  LED_GREEN  [LED_3216]
J5  IDC-10MS  [IDC-10MS]
J6  Header 2x4 2.54mm  [Header 2x4 2.54mm]
J7  Header 1x4 2.54mm  [Header 1x4 2.54mm]
Q9  NPN  [SOT23]  (value not drawn)
Q10  NPN  [SOT23]  (value not drawn)
Q11  NPN  [SOT23]  (value not drawn)
Q12  NPN  [SOT23]  (value not drawn)
Q13  NPN  [SOT23]  (value not drawn)
Q14  NPN  [SOT23]  (value not drawn)
Q15  NPN  [SOT23]  (value not drawn)
R51  value 4.7k  [RESC2012X06N]  (hidden comment: Resistor)
R52  value 4.7k  [RESC2012X06N]  (hidden comment: Resistor)
R53  value 4.7k  [RESC2012X06N]  (hidden comment: Resistor)
R54  value 10k  [RESC2012X06N]  (hidden comment: Resistor)
R55  value 10k  [RESC2012X06N]  (hidden comment: Resistor)
R56  value 10k  [RESC2012X06N]  (hidden comment: Resistor)
R57  value 10k  [RESC2012X06N]  (hidden comment: Resistor)
R58  value 0  [RESC2012X06N]  (hidden comment: Resistor)
R59  value 0  [RESC2012X06N]  (hidden comment: Resistor)
R60  value 0  [RESC2012X06N]  (hidden comment: Resistor)
R61  value 4.7k  [RESC2012X06N]  (hidden comment: Resistor)
R62  value 4.7k  [RESC2012X06N]  (hidden comment: Resistor)
R63  value 4.7k  [RESC2012X06N]  (hidden comment: Resistor)
R64  value 4.7k  [RESC2012X06N]  (hidden comment: Resistor)
R65  value 10k  [RESC2012X06N]  (hidden comment: Resistor)
R66  value 10k  [RESC2012X06N]  (hidden comment: Resistor)
R67  value 10k  [RESC2012X06N]  (hidden comment: Resistor)
R68  value 10k  [RESC2012X06N]  (hidden comment: Resistor)
R69  value 0  [RESC2012X06N]  (hidden comment: Resistor)
R70  value 0  [RESC2012X06N]  (hidden comment: Resistor)
R71  value 0  [RESC2012X06N]  (hidden comment: Resistor)
R72  value 0  [RESC2012X06N]  (hidden comment: Resistor)
R73  value 0  [RESC2012X06N]  (hidden comment: Resistor)
R74  value 0  [RESC2012X06N]  (hidden comment: Resistor)
R75  value 1k  [RESC2012X06N]  (hidden comment: Resistor)
R76  value 1k  [RESC2012X06N]  (hidden comment: Resistor)
R77  value 1k  [RESC2012X06N]  (hidden comment: Resistor)
R78  value 10k  [RESC2012X06N]  (hidden comment: Resistor)
R79  value 120  [RESC2012X06N]  (hidden comment: Resistor)
SW1  B3F-1000  [OMRON-B3F-1000-4_V]
U4  STM32F303CBT6  [STM-LQFP48_L]  (parts A,B of 2)
U5  SN65HVD230DR  [FP-D0008A-IPC_A]
Y1  NX3225GD-8MHZ-STD-CRA-3  [NDK-NX3225GD-8MHZ-STD-CRA-3_V]  (value not drawn)

### Ports
ADC_DC (in, see Senser[3D]), ADC_I (in, see Senser[3B]), COMP_U (in, see Senser[1D]), COMP_V (in, see Senser[2D]), COMP_W (in, see Senser[2D]), HALL_U (in, see Senser[4B]), HALL_V (in, see Senser[4B]), HALL_W (in, see Senser[4B]), PWM_H1 (out, see driver[1A]), PWM_H2 (out, see driver[3A]), PWM_H3 (out, see driver[1C]), PWM_L1 (out, see driver[1A]), PWM_L2 (out, see driver[3A]), PWM_L3 (out, see driver[1C]), SD (out, see driver[3C])

### Nets
+3.3: C41.1 C42.1 C43.1 C44.1 C45.1 C46.1 C47.2 C48.2 J6.1 J7.1 U4.1(VBAT) U4.9(VDDA/VREF+) U4.24(VDD_2) U4.36(VDD_3) U4.48(VDD_1) U5.3(VCC)
+12: R54.2 R55.1 R56.1 R57.1 R65.1 R66.1 R67.1
+E5: J5.9 J5.10
GND: C38.2 C39.2 C40.2 C41.2 C42.2 C43.2 C44.2 C45.2 C46.2 C47.1 C48.1 C50.2 D16.K D17.K D18.K J5.5 J5.6 J6.7 J6.8 J7.4 Q9.2(E) Q10.2(E) Q11.2(E) Q12.2(E) Q13.2(E) Q14.2(E) Q15.2(E) R68.2 R78.1 SW1.3 SW1.4 U4.8(VSSA/VREF-) U4.23(VSS_2) U4.35(VSS_3) U4.47(VSS_1) U5.2(GND)
adc_dc: R74.1 U4.12(PA2)
adc_i: R73.1 U4.11(PA1)
CAN_RX: U4.45(PB8) U5.4(R)
CAN_TX: U4.46(PB9) U5.1(D)
CANH: J7.3 R79.2 U5.7(CANH)
CANL: J7.2 R79.1 U5.6(CANL)
comp_u: R69.1 U4.17(PA7)
comp_v: R70.1 U4.18(PB0)
comp_w: R71.1 U4.22(PB11)
DAC1: R76.2 U4.14(PA4)
DAC2: R75.2 U4.15(PA5)
H1: Q10.3(C) R55.2 ; port PWM_H1
H2: Q11.3(C) R56.2 ; port PWM_H2
H3: Q13.3(C) R65.2 ; port PWM_H3
hall_u: R58.1 U4.39(PB3)
hall_v: R59.1 U4.38(PA15)
hall_w: R60.1 U4.21(PB10)
L1: Q12.3(C) R57.2 ; port PWM_L1
L2: Q14.3(C) R66.2 ; port PWM_L2
L3: Q15.3(C) R67.2 ; port PWM_L3
LED: R77.2 U4.19(PB1)
over_current: R72.1 U4.10(PA0)
PA3: J6.6 U4.13(PA3)
PB4: J6.2 U4.40(PB4)
PB5: J6.3 U4.41(PB5)
PB6: J6.5 U4.42(PB6)
PB7: J6.4 U4.43(PB7)
PWM_h1: R51.1 U4.31(PA10)
PWM_h2: R52.1 U4.30(PA9)
PWM_h3: R62.1 U4.29(PA8)
PWM_l1: R53.1 U4.28(PB15)
PWM_l2: R63.1 U4.27(PB14)
PWM_l3: R64.1 U4.26(PB13)
R_BUTTON: C40.1 SW1.1 SW1.2 U4.7(NRST)
sd: C50.1 Q9.3(C) R54.1 ; port SD
SWCLK: J5.2 U4.37(PA14)
SWDIO: J5.4 U4.34(PA13)
NetC28_1: R69.2 ; port COMP_U
NetC29_1: R70.2 ; port COMP_V
NetC30_1: R71.2 ; port COMP_W
NetC32_1: R74.2 ; port ADC_DC
NetC33_1: R72.2 R73.2 ; port ADC_I
NetC35_1: R58.2 ; port HALL_U
NetC36_1: R59.2 ; port HALL_V
NetC37_1: R60.2 ; port HALL_W
NetC38_1: C38.1 U4.5(PF0-OSC_IN(PF0)) Y1.1
NetC39_1: C39.1 U4.6(PF1-OSC_OUT(PF1)) Y1.2
NetD16_A: D16.A R75.1
NetD17_A: D17.A R76.1
NetD18_A: D18.A R77.1
NetQ9_1: Q9.1(B) R61.1
NetQ10_1: Q10.1(B) R51.2
NetQ11_1: Q11.1(B) R52.2
NetQ12_1: Q12.1(B) R53.2
NetQ13_1: Q13.1(B) R62.2
NetQ14_1: Q14.1(B) R63.2
NetQ15_1: Q15.1(B) R64.2
NetR61_2: R61.2 U4.32(PA11)
NetR68_1: R68.1 U4.44(BOOT0)
NetR78_2: R78.2 U5.8(RS)

Not connected (* = marked no-connect by the designer): J5 1* 3* 7* 8*; U4 2(PC13)* 3(PC14-OSC32_IN(PC14))* 4(PC15-OSC32_OUT(PC15))* 16(PA6)* 20(PB2)* 25(PB12)* 33(PA12)*; U5 5(VREF)*

### Notes on the sheet
- MCU
- SWD
- CAN
- PWM
- (near R69) Comparator
- (near R72) ADC
- (near R58) HALLS

### Library data of the parts
C40 C42-C46 = CAP: as C27 on sheet Senser; Source: *
C41 = CAP: Конденсатор керамический smd 4.7 мкФ X5R 10% 25В 0805; Source: *
C47 C50 = CAP: as C20 on sheet driver; Source: *
D16-D18 = LED_GREEN: TO-3216BC-BF, Светодиод синий SMD 3216
J5 = IDC-10MS: Вилка на плату прямая 2x5 2.54мм
J6 = Header 2x4
J7 = Header 1x4: PLS-4 (DS-1021-1x4), Вилка штыревая 2.54мм 1x4pin
Q9-Q15 = NPN: BC817,215, Транзистор NPN 45В 0.5А
R51-R53 R61-R64 = Resistor: 0.125Вт 0805 4.7 кОм, 1%; Source: *
R54-R57 R65-R68 R78 = Resistor: 0.125Вт 0805 10 кОм, 1%; Source: *
R58-R60 R69-R74 = Resistor: 0.125Вт 0805 (перемычка) 0 Ом, 1%; Source: *
R75-R77 = Resistor: 0.125Вт 0805 1 кОм, 1%; Source: *
R79 = Resistor: 0.125Вт 0805 120 Ом, 1%; Source: *
SW1 = CMP-011-00004-2: Tactile Switch, SPST-NO, 0.05 A, 24 V, -25 to 70 degC, 4-Pin THD, RoHS, Bulk; Manufacturer: Omron Electronic Components; Throw Configuration: SPST; Max Contact Resistance: 100mohm; Resistance: 0.1Ohm; Max Current Rating: 50mA; Voltage Rating: 24V; Operating Force: 100gf; Datasheet Version: Jan-15; Case/Package: B3F-1000; Packaging: Bulk; Package Description: 4-Pin Through Hole Device, Body 6 x 6 mm; Manufacturer URL: http://www.omron.com/; Package Reference: B3F-1000; Contact Plating: Gold; Contact Current Rating: 50mA; RoHS Compliant: True; Contact Material: Gold; Mounting Technology: TH; Max Operating Temperature: 70°C; Min Operating Temperature: -25°C; Package Quantity: 1500; Datasheet URL: http://www.omron.com/ecb/products/pdf/en-b3f.pdf; Voltage Rating (DC): 24V; Pins: 4; Current Rating: 50mA; Max Voltage Rating (DC): 24V
U4 = CMP-0572-00014-2: ARM Cortex-M4 32-bit MCU, 128 KB Flash, 32 KB Internal RAM, 37 I/Os, 48-pin LQFP, -40 to 85 degC, Tray; Internal RAM Size (kB): 32; Supply Voltage(Vcc) min (V): 2; Operating Frequency(F) (Processor speed) (MHz): 72; FLASH Size (Prog) (kB): 128; I/Os (High Current): 37; D/A Converter: 2x12-bit (2 Channel); PackageDescription: 48-Pin Low Profile Quad Flat Package, 7 x 7 mm Body, 0.5 mm Pitch; ComponentLink1URL: http://www.st.com/web/en/home.html; Packing: Tray; ComponentLink1Description: Manufacturer URL; DatasheetVersion: Rev. 6; Mounting Technology: Surface Mount; PartNumber: STM32F303CBT6; Core: ARM Cortex-M4; ComponentLink2URL: http://www.st.com/st-web-ui/static/active/en/resource/technical/document/datasheet/DM00058181.pdf; ComponentLink3URL: http://www.st.com/st-web-ui/static/active/en/resource/technical/document/datasheet/DM00058181.pdf; PackageReference: LQFP48; ComponentLink3Description: Package Specification; PackageVersion: Rev. 6, 06/2013; ComponentLink2Description: Datasheet
U5 = CMP-0315-00015-3: IC TRANSCEIVER HALF 1/1 8SOIC; Number of Transceivers: 1; Operating Supply Voltage: 3.3V; Number of I/Os: 2; Max Supply Current: 17mA; Max Supply Voltage: 3.6V; Min Supply Voltage: 3V; Data Rate: 1Mbps; Min Operating Temperature: -40°C; Packaging: Tape and Reel; Lead Free: Lead Free; Number of Transmit Buffers: 1; Max Operating Temperature: 85°C; Number of Receive Buffers: 1; Number of Pins: 8; Package Quantity: 1; Radiation Hardening: No; Case/Package: D; REACH SVHC: No SVHC; Weight: 0.002561oz; Termination: SMD/SMT; Contact Plating: Gold; Nominal Supply Current: 17mA; Number of Receivers: 1; Number of Drivers: 1
Y1 = CMP-2000-07595-1: Crystal Unit, 8 MHz, 8 pF, -40 to 150 degC, 2-Pin SMD, RoHS, Tape and Reel; Manufacturer: NDK; Load Capacitance: 8pF; ESR (Equivalent Series Resistance): 500Ohm; Frequency Tolerance: 50ppm; Frequency Stability: 150ppm; Frequency: 8MHz; Case/Package: SMD/SMT; Datasheet Version: 11/2016; Min Operating Temperature: -40degC; Packaging: TapeandReel; Width: 0.098inch; Package Quantity: 3000; Number of Pins: 2; Package Description: 2-Pin Surface Mount Device, Body 3.2 x 2.5 mm; RoHSCompliant: True; Package Reference: NX3225GD-8MHZ-STD-CRA-3; Datasheet URL: http://www.ndk.com/images/products/catalog/c_NX3225GD-STD-CRA-3_e.pdf; Mounting Technology: SurfaceMount; Length: 0.126inch; Mount: SurfaceMount; Manufacturer URL: http://www.ndk.com/en/; Max Operating Temperature: 150degC; Height: 0.039inch
C38 C39 C48 = CAP: Source: *

## Nets that join several sheets
+3.3: power (5 pins), Senser (J4.1 R48.2 R49.2 R50.2), mcu (16 pins)
+12: power (D3.2 J2.2 R5.2), driver (15 pins), Senser (C31.1 C34.1 R35.2 U3.8), mcu (7 pins)
+E5: power (D4.2), mcu (J5.9 J5.10)
GND: inventer (10 pins), power (23 pins), driver (6 pins), Senser (18 pins), mcu (36 pins)
VM: inventer (9 pins), power (7 pins), Senser (R45.2)
com: inventer (10 pins), driver (6 pins)
H1: driver (IC2.12), mcu (Q10.3 R55.2)
H2: driver (IC3.12), mcu (Q11.3 R56.2)
H3: driver (IC1.12), mcu (Q13.3 R65.2)
L1: driver (IC2.14), mcu (Q12.3 R57.2)
L2: driver (IC3.14), mcu (Q14.3 R66.2)
L3: driver (IC1.14), mcu (Q15.3 R67.2)
NetC13_1: inventer (C13.1 R13.2), Senser (R39.1)
NetC13_2: inventer (C13.2 R14.2), Senser (R40.1)
NetC20_2: inventer (J3.3 Q7.S Q8.D R28.1), driver (C20.2 IC1.6), Senser (R43.2)
NetC28_1: Senser (C28.1 R33.1 R34.2), mcu (R69.2)
NetC29_1: Senser (C29.1 R37.1 R38.2), mcu (R70.2)
NetC30_1: Senser (C30.1 R43.1 R44.2), mcu (R71.2)
NetC32_1: Senser (C32.1 R45.1 R46.2), mcu (R74.2)
NetC33_1: Senser (C33.1 R47.2), mcu (R72.2 R73.2)
NetC35_1: Senser (C35.1 J4.2 R48.1), mcu (R58.2)
NetC36_1: Senser (C36.1 J4.3 R49.1), mcu (R59.2)
NetC37_1: Senser (C37.1 J4.4 R50.1), mcu (R60.2)
NetD7_1: inventer (D7.1 R7.1), driver (IC2.8)
NetD8_1: inventer (D8.1 R9.1), driver (IC2.1)
NetD9_1: inventer (D9.1 R15.1), driver (IC3.8)
NetD10_1: inventer (D10.1 R17.1), driver (IC3.1)
NetD11_1: inventer (D11.1 R24.1), driver (IC1.8)
NetD12_1: inventer (D12.1 R26.1), driver (IC1.1)
sd: driver (IC1.13 IC2.13 IC3.13), mcu (C50.1 Q9.3 R54.1)
U: inventer (J3.1 Q3.S Q4.D R11.1), driver (C22.2 IC2.6), Senser (R33.2)
V: inventer (J3.2 Q5.S Q6.D R19.1), driver (C25.2 IC3.6), Senser (R37.2)